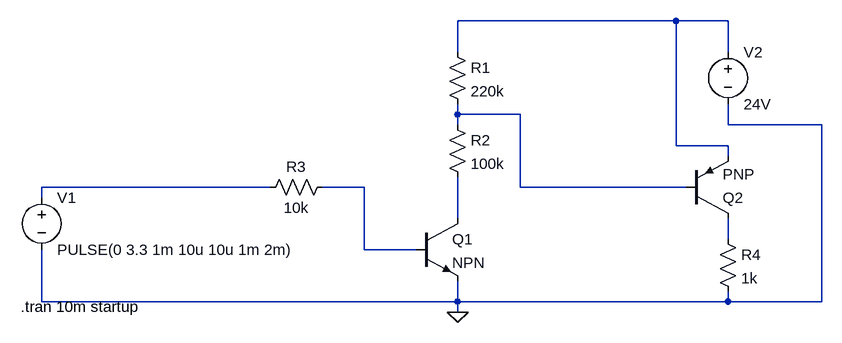
[diagram p0: schematic high-side-switch.asc]
high-side-switch.asc, the LTspice schematic file:
Version 4
SHEET 1 1236 680
WIRE 1008 -64 672 -64
WIRE 1088 -64 1008 -64
WIRE 672 -16 672 -64
WIRE 1088 -16 1088 -64
WIRE 672 80 672 64
WIRE 768 80 672 80
WIRE 672 96 672 80
WIRE 1088 96 1088 64
WIRE 1232 96 1088 96
WIRE 1008 128 1008 -64
WIRE 1088 128 1008 128
WIRE 1088 144 1088 128
WIRE 384 192 32 192
WIRE 528 192 464 192
WIRE 768 192 768 80
WIRE 1024 192 768 192
WIRE 32 208 32 192
WIRE 672 240 672 176
WIRE 1088 272 1088 240
WIRE 528 288 528 192
WIRE 608 288 528 288
WIRE 32 368 32 288
WIRE 672 368 672 336
WIRE 672 368 32 368
WIRE 1088 368 1088 352
WIRE 1088 368 672 368
WIRE 1232 368 1232 96
WIRE 1232 368 1088 368
WIRE 672 384 672 368
FLAG 672 384 0
SYMBOL voltage 32 192 R0
WINDOW 123 0 0 Left 0
WINDOW 39 0 0 Left 0
SYMATTR InstName V1
SYMATTR Value PULSE(0 3.3 1m 10u 10u 1m 2m)
SYMBOL voltage 1088 -32 R0
WINDOW 123 0 0 Left 0
WINDOW 39 0 0 Left 0
SYMATTR InstName V2
SYMATTR Value 24V
SYMBOL res 656 -32 R0
SYMATTR InstName R1
SYMATTR Value 220k
SYMBOL res 656 80 R0
SYMATTR InstName R2
SYMATTR Value 100k
SYMBOL res 480 176 R90
WINDOW 0 0 56 VBottom 2
WINDOW 3 32 56 VTop 2
SYMATTR InstName R3
SYMATTR Value 10k
SYMBOL npn 608 240 R0
SYMATTR InstName Q1
SYMBOL pnp 1024 240 M180
SYMATTR InstName Q2
SYMBOL res 1072 256 R0
SYMATTR InstName R4
SYMATTR Value 1k
TEXT 0 376 Left 2 !.tran 10m startup

The netlist it stands for:
* high-side-switch.asc
V1 N003 0 PULSE(0 3.3 1m 10u 10u 1m 2m)
V2 N001 0 24V
R1 N001 N002 220k
R2 N002 N005 100k
R3 N004 N003 10k
Q1 N005 N004 0 0 NPN
Q2 N006 N002 N001 0 PNP
R4 N006 0 1k
.model NPN NPN
.model PNP PNP
.lib standard.bjt
.tran 10m startup
.backanno
.end